# Altium schematic sheet Connectors.SchDoc
size A4
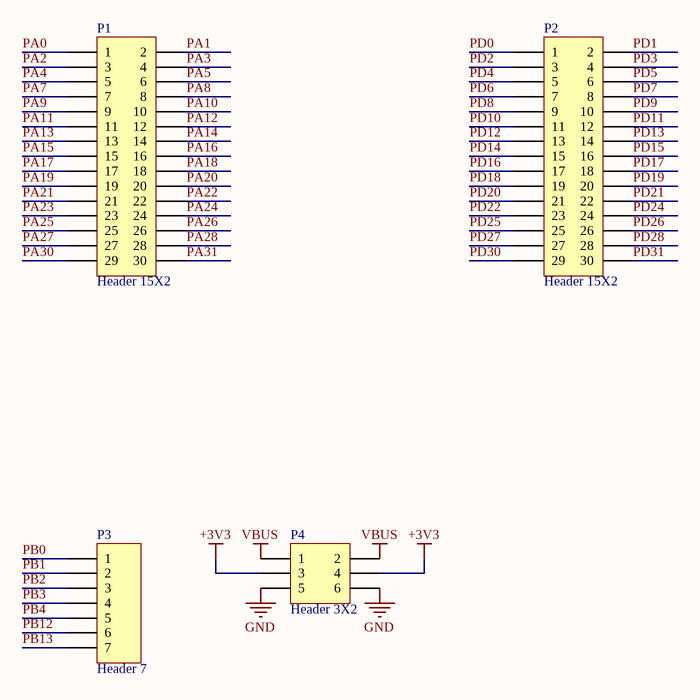
[diagram p0: Connectors.SchDoc]

## Parts
P1  Header 15X2  [HDR2X15]
P2  Header 15X2  [HDR2X15]
P3  Header 7  [HDR1X7]
P4  Header 3X2  [HDR2X3]

## Nets
+3V3: P4.3 P4.4
GND: P4.5 P4.6
VBUS: P4.1 P4.2
PA0: P1.1
PA1: P1.2
PA2: P1.3
PA3: P1.4
PA4: P1.5
PA5: P1.6
PA7: P1.7
PA8: P1.8
PA9: P1.9
PA10: P1.10
PA11: P1.11
PA12: P1.12
PA13: P1.13
PA14: P1.14
PA15: P1.15
PA16: P1.16
PA17: P1.17
PA18: P1.18
PA19: P1.19
PA20: P1.20
PA21: P1.21
PA22: P1.22
PA23: P1.23
PA24: P1.24
PA25: P1.25
PA26: P1.26
PA27: P1.27
PA28: P1.28
PA30: P1.29
PA31: P1.30
PB0: P3.1
PB1: P3.2
PB2: P3.3
PB3: P3.4
PB4: P3.5
PB12: P3.6
PB13: P3.7
PD0: P2.1
PD1: P2.2
PD2: P2.3
PD3: P2.4
PD4: P2.5
PD5: P2.6
PD6: P2.7
PD7: P2.8
PD8: P2.9
PD9: P2.10
PD10: P2.11
PD11: P2.12
PD12: P2.13
PD13: P2.14
PD14: P2.15
PD15: P2.16
PD16: P2.17
PD17: P2.18
PD18: P2.19
PD19: P2.20
PD20: P2.21
PD21: P2.22
PD22: P2.23
PD24: P2.24
PD25: P2.25
PD26: P2.26
PD27: P2.27
PD28: P2.28
PD30: P2.29
PD31: P2.30

## Library data of the parts
P1 P2 = Header 15X2: Header, 15-Pin, Dual row; LatestRevisionDate: 17-Jul-2002; LatestRevisionNote: Re-released for DXP Platform.; Publisher: Altium Limited
P3 = Header 7: Header, 7-Pin; LatestRevisionDate: 17-Jul-2002; LatestRevisionNote: Re-released for DXP Platform.; Publisher: Altium Limited
P4 = Header 3X2: Header, 3-Pin, Dual row; LatestRevisionDate: 17-Jul-2002; LatestRevisionNote: Re-released for DXP Platform.; Publisher: Altium Limited